# EAGLE design HY28B-LCD (EAGLE 6.4)
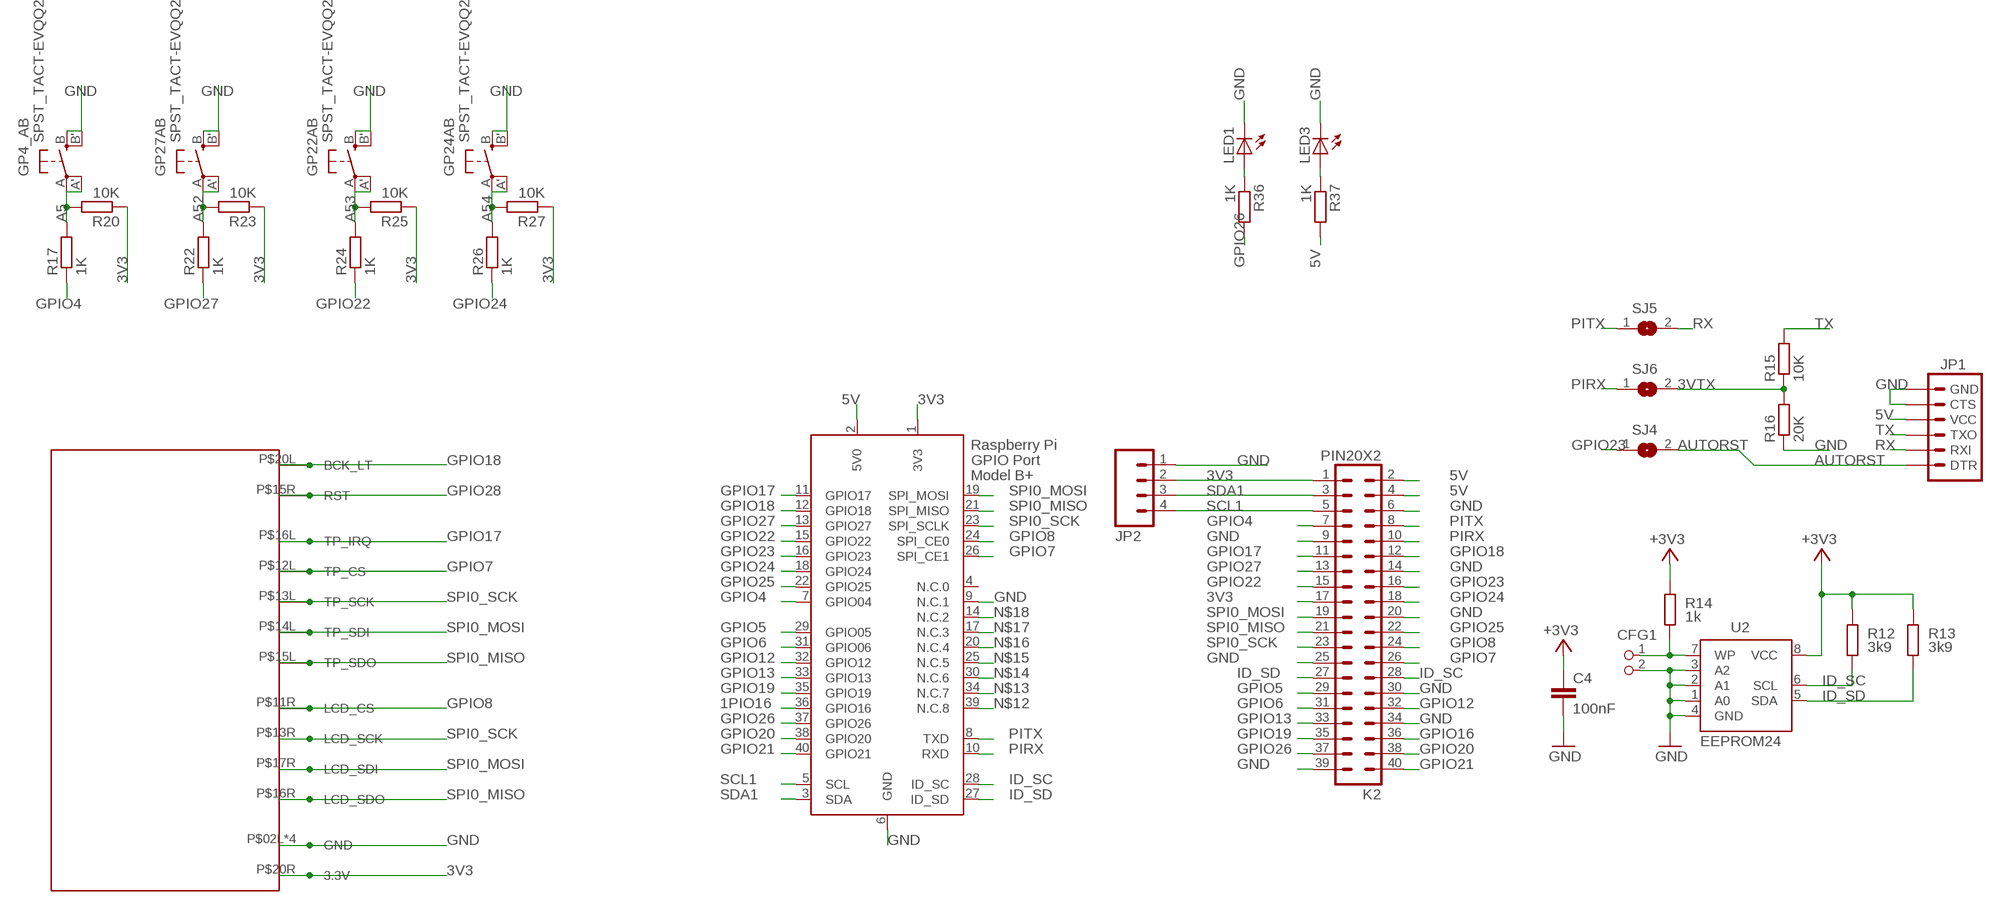
[diagram p0: schematic, sheet 1]

## Parts
C4  100nF  C-EUC1206  [C1206]
CFG1  PIN2_100  [PIN_W_2]
GP4_AB  SPST_TACT-EVQQ2  [EVQ-Q2]
GP22AB  SPST_TACT-EVQQ2  [EVQ-Q2]
GP24AB  SPST_TACT-EVQQ2  [EVQ-Q2]
GP27AB  SPST_TACT-EVQQ2  [EVQ-Q2]
JP1  ARDUINO_SERIAL_PROGRAMLOCK  [1X06_LOCK]
JP2  M04LOCK  [1X04_LOCK]
K2  PIN20X2  [PIN_20X2]
LED1  LEDCHIPLED_1206  [CHIPLED_1206]
LED3  LEDCHIPLED_1206  [CHIPLED_1206]
R12  3k9  R-EU_M1206  [M1206]
R13  3k9  R-EU_M1206  [M1206]
R14  1k  R-EU_M1206  [M1206]
R15  10K  RESISTOR-1206  [R1206]
R16  20K  RESISTOR-1206  [R1206]
R17  1K  R-EU_M1206  [M1206]
R20  10K  R-EU_M1206  [M1206]
R22  1K  R-EU_M1206  [M1206]
R23  10K  R-EU_M1206  [M1206]
R24  1K  R-EU_M1206  [M1206]
R25  10K  R-EU_M1206  [M1206]
R26  1K  R-EU_M1206  [M1206]
R27  10K  R-EU_M1206  [M1206]
R36  1K  RESISTOR-1206  [R1206]
R37  1K  RESISTOR-1206  [R1206]
SJ4  SJ  [SJ]
SJ5  SJ  [SJ]
SJ6  SJ  [SJ]
U2  EEPROM24  [SOIC8]
U$1  HY28BSTD  [HY28B]
X1  RASPI_BOARD_B+_F  [RASPI_BOARD_B+_FULL]

## Nets
1PIO16: X1.36(GPIO16)
3V3: JP2.2 K2.1 K2.17 R20.1 R23.1 R25.1 R27.1 U$1.P$20R(3.3V) X1.1(3V3)
3VTX: R15.1 R16.2 SJ6.2
5V: JP1.4(VCC) K2.2 K2.4 R37.2 X1.2(5V0)
+3V3: C4.1 R12.2 R13.2 R14.2 U2.8(VCC)
A5: GP4_AB.A'(P1) GP4_AB.A(P) R17.2 R20.2
A52: GP27AB.A'(P1) GP27AB.A(P) R22.2 R23.2
A53: GP22AB.A'(P1) GP22AB.A(P) R24.2 R25.2
A54: GP24AB.A'(P1) GP24AB.A(P) R26.2 R27.2
AUTORST: JP1.1(DTR) SJ4.2
GND: C4.2 CFG1.2 GP4_AB.B'(S1) GP4_AB.B(S) GP22AB.B'(S1) GP22AB.B(S) GP24AB.B'(S1) GP24AB.B(S) GP27AB.B'(S1) GP27AB.B(S) JP1.5(CTS) JP1.6(GND) JP2.1 K2.6 K2.9 K2.14 K2.20 K2.25 K2.30 K2.34 K2.39 LED1.C LED3.C R16.1 U2.1(A0) U2.2(A1) U2.3(A2) U2.4(GND) U$1.P$02L(GND) U$1.P$02R(GND) U$1.P$19L(GND) U$1.P$19R(GND) X1.6(GND) X1.9(N.C.1)
GPIO4: K2.7 R17.1 X1.7(GPIO04)
GPIO5: K2.29 X1.29(GPIO05)
GPIO6: K2.31 X1.31(GPIO06)
GPIO7: K2.26 U$1.P$12L(TP_CS) X1.26(SPI_CE1)
GPIO8: K2.24 U$1.P$11R(LCD_CS) X1.24(SPI_CE0)
GPIO12: K2.32 X1.32(GPIO12)
GPIO13: K2.33 X1.33(GPIO13)
GPIO16: K2.36
GPIO17: K2.11 U$1.P$16L(TP_IRQ) X1.11(GPIO17)
GPIO18: K2.12 U$1.P$20L(BCK_LT) X1.12(GPIO18)
GPIO19: K2.35 X1.35(GPIO19)
GPIO20: K2.38 X1.38(GPIO20)
GPIO21: K2.40 X1.40(GPIO21)
GPIO22: K2.15 R24.1 X1.15(GPIO22)
GPIO23: K2.16 SJ4.1 X1.16(GPIO23)
GPIO24: K2.18 R26.1 X1.18(GPIO24)
GPIO25: K2.22 X1.22(GPIO25)
GPIO26: K2.37 R36.2 X1.37(GPIO26)
GPIO27: K2.13 R22.1 X1.13(GPIO27)
GPIO28: U$1.P$15R(RST)
ID_SC: K2.28 R12.1 U2.6(SCL) X1.28(ID_SC)
ID_SD: K2.27 R13.1 U2.5(SDA) X1.27(ID_SD)
N$1: CFG1.1 R14.1 U2.7(WP)
N$2: LED1.A R36.1
N$3: LED3.A R37.1
N$12: X1.39(N.C.8)
N$13: X1.34(N.C.7)
N$14: X1.30(N.C.6)
N$15: X1.25(N.C.5)
N$16: X1.20(N.C.4)
N$17: X1.17(N.C.3)
N$18: X1.14(N.C.2)
PIRX: K2.10 SJ6.1 X1.10(RXD)
PITX: K2.8 SJ5.1 X1.8(TXD)
RX: JP1.2(RXI) SJ5.2
SCL1: JP2.4 K2.5 X1.5(SCL)
SDA1: JP2.3 K2.3 X1.3(SDA)
SPI0_MISO: K2.21 U$1.P$15L(TP_SDO) U$1.P$16R(LCD_SDO) X1.21(SPI_MISO)
SPI0_MOSI: K2.19 U$1.P$14L(TP_SDI) U$1.P$17R(LCD_SDI) X1.19(SPI_MOSI)
SPI0_SCK: K2.23 U$1.P$13L(TP_SCK) U$1.P$13R(LCD_SCK) X1.23(SPI_SCLK)
TX: JP1.3(TXO) R15.2
Unconnected: X1.4(N.C.0)

## Library data of the parts
C4 = resistor:C-EU: CAPACITOR, European symbol; DIELECTRIC: X7R
CFG1 = FLYFISH:PIN2
GP4_AB GP22AB GP24AB GP27AB = adafruit:SPST_TACT: SMT 6mm switch, EVQQ2 series http://www.ladyada.net/library/eagle
JP1 = SparkFun-Connectors:ARDUINO_SERIAL_PROGRAM: FTDI connector footprints
JP2 = SparkFun-Connectors:M04: Header 4 Standard 4-pin 0.1" header. Use with straight break away headers (SKU : PRT-00116), right angle break away headers (PRT-00553), swiss pins (PRT-00743), machine pins (PRT-00117), and female headers (PRT-00115). Molex polarized connector foot print use with SKU : PRT-08231 with associated crimp pins and housings. 1MM SMD Version SKU: PRT-10208
K2 = FLYFISH:PIN20X2
LED1 LED3 = adafruit:LED: LED OSRAM: - CHIPLED LG R971, LG N971, LY N971, LG Q971, LY Q971, LO R971, LY R971 LH N974, LH R974 LS Q976, LO Q976, LY Q976 LO Q996 - Hyper CHIPLED LW Q18S LB Q993, LB Q99A, LB R99A - SideLED LS A670, LO A670, LY A670, LG A670, LP A670 LB A673, LV A673, LT A673, LW A673 LH A674 LY A675 LS A676, LA A676, LO A676, LY A676, LW A676 LS A679, LY A679, LG A679 - Hyper Micro SIDELED® LS Y876, LA Y876, LO Y876, LY Y876 LT Y87S - SmartLED LW L88C, LW L88S LB L89C, LB L89S, LG L890 LS L89K, LO L89K, LY L89K LS L896, LA L896, LO L896, LY L896 - TOPLED LS T670, LO T670, LY T670, LG T670, LP T670 LSG T670, LSP T670, LSY T670, LOP T670, LYG T670 LG T671, LOG T671, LSG T671 LB T673, LV T673, LT T673, LW T673 LH T674 LS T676, LA T676, LO T676, LY T676, LB T676, LH T676, LSB T676, LW T676 LB T67C, LV T67C, LT T67C, LS T67K, LO T67K, LY T67K, LW E67C LS E67B, LA E67B, LO E67B, LY E67B, LB E67C, LV E67C, LT E67C LW T67C LS T679, LY T679, LG T679 LS T770, LO T770, LY T770, LG T770, LP T770 LB T773, LV T773, LT T773, LW T773 LH T774 LS E675, LA E675, LY E675, LS T675 LS T776, LA T776, LO T776, LY T776, LB T776 LHGB T686 LT T68C, LB T68C - Hyper Mini TOPLED® LB M676 - Mini TOPLED Santana® LG M470 LS M47K, LO M47K, LY M47K Source: http://www.osram.convergy.de/
R12-R14 = resistor:R-EU_: RESISTOR, European symbol; TOLERANCE: 5%
R15 R16 R36 R37 = dp_devices:RESISTOR
R17 R20 R22-R27 = resistor:R-EU_: RESISTOR, European symbol
SJ4-SJ6 = jumper:SJ: SMD solder JUMPER
U2 = FLYFISH:EEPROM24
U$1 = hy28b:HY28B
X1 = raspberrypi_bastelstube_v13:RASPI_BOARD_B+: Raspberry Pi GPIO connector with markings for the outer dimensions of the Raspberry Pi board model B+ with different sets of drill holes or mounting pads

## Board
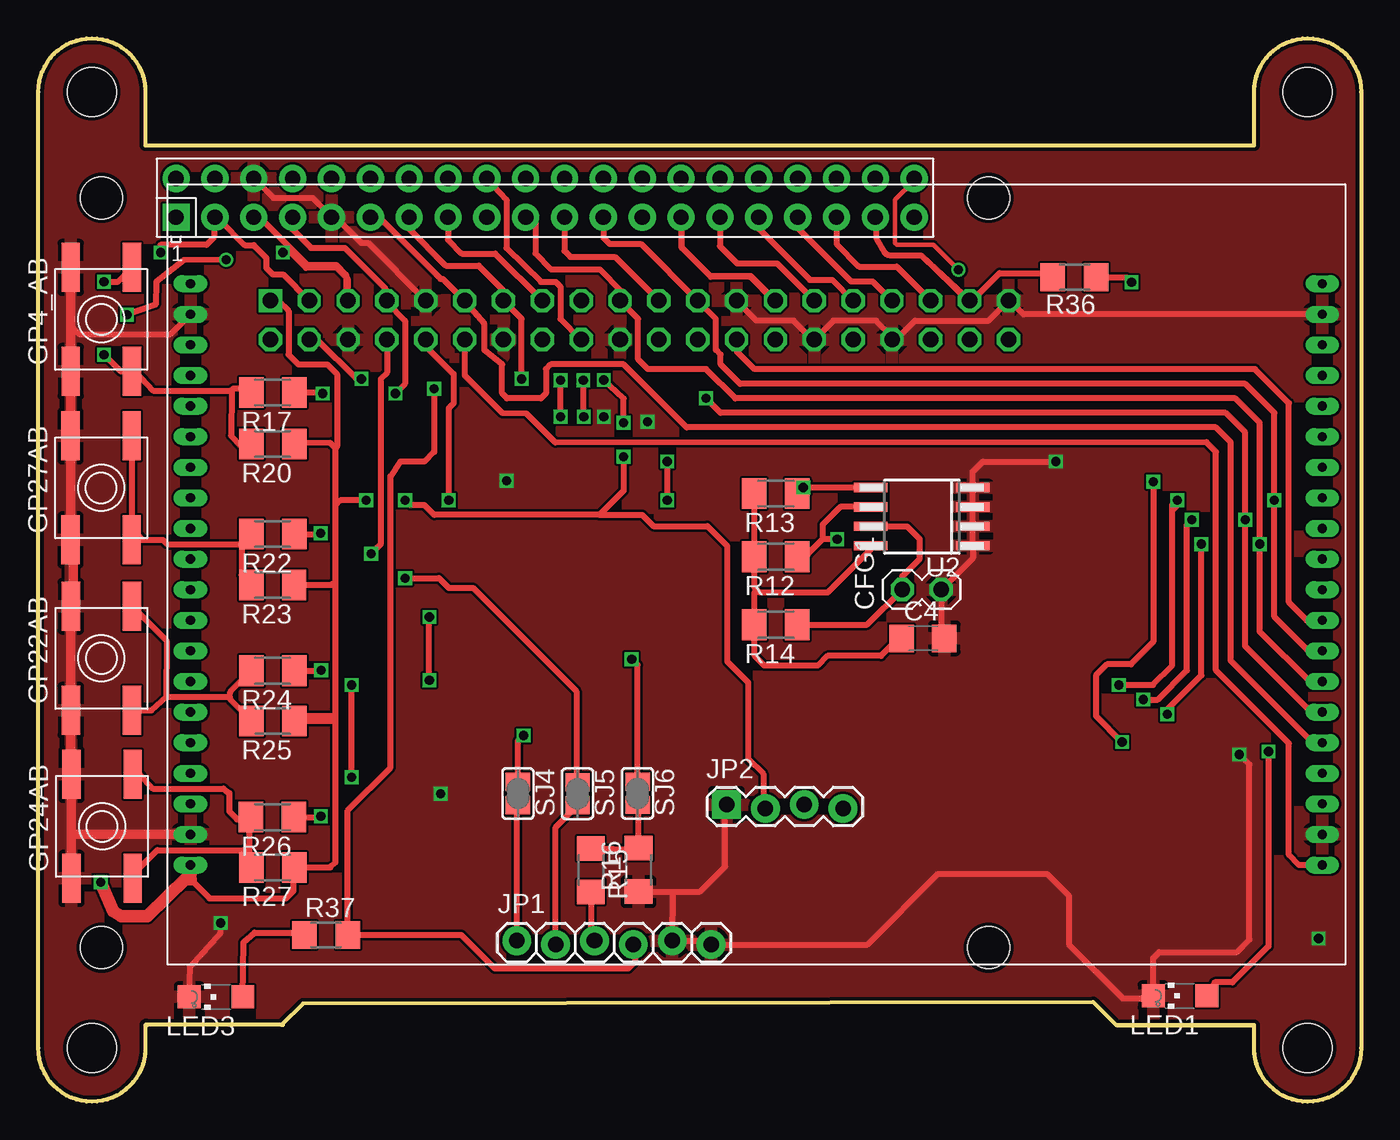
[diagram p1: board, top side]
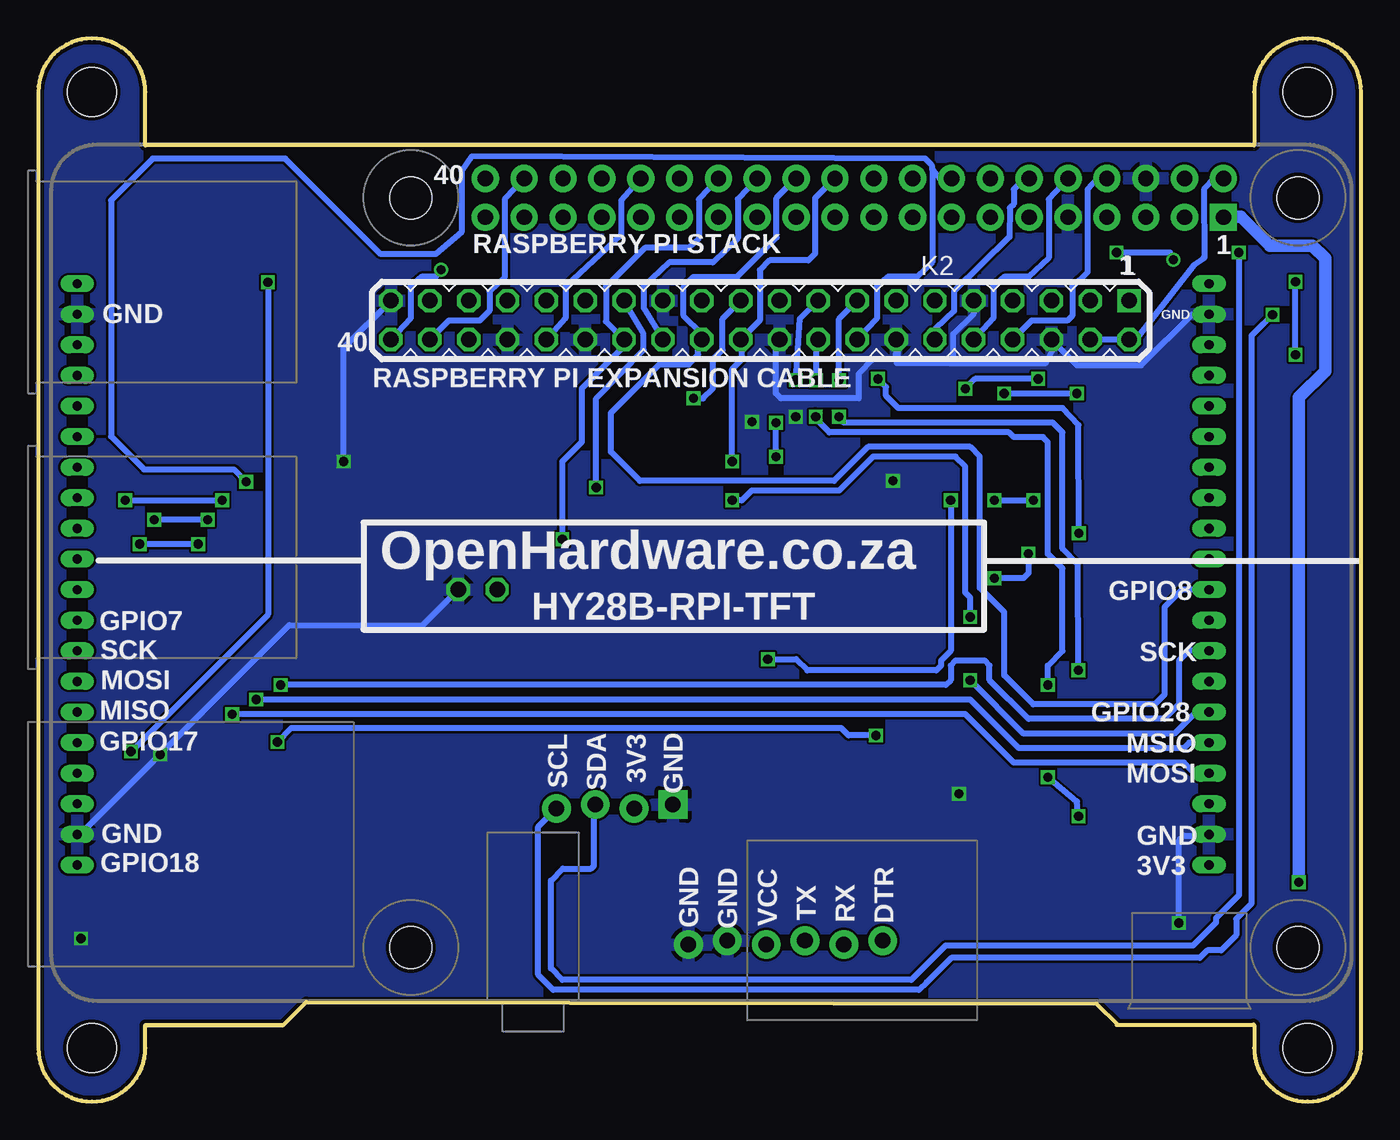
[diagram p2: board, bottom side, seen from below]

Size 86.5 x 69.5 mm. Coordinates in mm from the lower left corner, seen from the top.
Outline: 79.5,5 79.5,3.5 arc180 86.5,3.5 86.5,66 arc180 79.5,66 79.5,62.5 7,62.5 7,66 arc180 0,66 0,3.5 arc180 7,3.5 7,4.98
Outline: 79.5,5 79.46,4.97 79.5,5 70.47,5 68.98,6.5 17.3,6.41 15.92,5.02 7.15,5.02 7,4.98
Outline: 7,4.98 7.06,5.04
Outline: 16,5.02 7,5.02
Outline: 70.5,5 79.5,5
Copper layers (1*16): Top 0.035mm / dielectric 1.5mm / Bottom 0.035mm
Design rules "dirt_cheap_dirty_boards.v1 *": minimum track width 5mil, minimum drill 12mil, track to track 6mil, track to pad 6mil, pad to pad 6mil, via to via 6mil, smd to smd 0mil, copper to edge 10mil, drill to drill 10mil, minimum pad ring 10mil, minimum via ring 6mil, stop-mask expansion 2mil, vias tented up to drill 25mil, thermal gap 10mil
Holes 3.2 mm at 83,3.5 3.5,3.5 3.5,66 83,66

### Footprints (pad centres in the part's own frame; a part is rotated, then mirrored left to right if it is on the bottom)
C1206 = smd 1.6 x 1.8: 1 -1.4,0; 2 1.4,0
PIN_W_2 = drill 1.016 octagon: 1 0,0; 2 0,-2.54
EVQ-Q2 = smd 3.2 x 1.2: A -3.4,-2; A' 3.4,-2; B -3.4,2; B' 3.4,2
1X06_LOCK = drill 1.016 pad 1.88: 1 0,0; 2 2.54,-0.254; 3 5.08,0; 4 7.62,-0.254; 5 10.16,0; 6 12.7,-0.254
1X04_LOCK = drill 1.016 pad 1.88 square: 1 0,0.127 | drill 1.016 pad 1.88: 2 2.54,-0.127; 3 5.08,0.127; 4 7.62,-0.127
PIN_20X2 = drill 1.016 square: 1 -24.13,-1.27 | drill 1.016 octagon: 2 -24.13,1.27; 3 -21.59,-1.27; 4 -21.59,1.27; 5 -19.05,-1.27; 6 -19.05,1.27; 7 -16.51,-1.27; 8 -16.51,1.27; 9 -13.97,-1.27; 10 -13.97,1.27; 11 -11.43,-1.27; 12 -11.43,1.27; 13 -8.89,-1.27; 14 -8.89,1.27; 15 -6.35,-1.27; 16 -6.35,1.27; 17 -3.81,-1.27; 18 -3.81,1.27; 19 -1.27,-1.27; 20 -1.27,1.27; 21 1.27,-1.27; 22 1.27,1.27; 23 3.81,-1.27; 24 3.81,1.27; 25 6.35,-1.27; 26 6.35,1.27; 27 8.89,-1.27; 28 8.89,1.27; 29 11.43,-1.27; 30 11.43,1.27; 31 13.97,-1.27; 32 13.97,1.27; 33 16.51,-1.27; 34 16.51,1.27; 35 19.05,-1.27; 36 19.05,1.27; 37 21.59,-1.27; 38 21.59,1.27; 39 24.13,-1.27; 40 24.13,1.27
CHIPLED_1206 = smd 1.5 x 1.5: A 0,-1.75; C 0,1.75
M1206 = smd 1.6 x 2: 1 -1.4,0; 2 1.4,0
R1206 = smd 1.6 x 1.803: 1 -1.422,0; 2 1.422,0
SJ = smd 1.168 x 1.6: 1 -0.762,0; 2 0.762,0
SOIC8 = smd 0.6 x 2.2: 1 -1.905,-3.33; 2 -0.635,-3.33; 3 0.635,-3.33; 4 1.905,-3.33; 5 1.905,3.33; 6 0.635,3.33; 7 -0.635,3.33; 8 -1.905,3.33
HY28B = drill 0.6 long: P$01L 74,38; P$01R 0,38; P$02L 74,36; P$02R 0,36; P$03L 74,34; P$03R 0,34; P$04L 74,32; P$04R 0,32; P$05L 74,30; P$05R 0,30; P$06L 74,28; P$06R 0,28; P$07L 74,26; P$07R 0,26; P$08L 74,24; P$08R 0,24; P$09L 74,22; P$09R 0,22; P$10L 74,20; P$10R 0,20; P$11L 74,18; P$11R 0,18; P$12L 74,16; P$12R 0,16; P$13L 74,14; P$13R 0,14; P$14L 74,12; P$14R 0,12; P$15L 74,10; P$15R 0,10; P$16L 74,8; P$16R 0,8; P$17L 74,6; P$17R 0,6; P$18L 74,4; P$18R 0,4; P$19L 74,2; P$19R 0,2; P$20L 74,0; P$20R 0,0
RASPI_BOARD_B+_FULL = drill 1 pad 1.778 square: 1 8.37,51.23 | drill 1 pad 1.778: 2 8.37,53.77; 3 10.91,51.23; 4 10.91,53.77; 5 13.45,51.23; 6 13.45,53.77; 7 15.99,51.23; 8 15.99,53.77; 9 18.53,51.23; 10 18.53,53.77; 11 21.07,51.23; 12 21.07,53.77; 13 23.61,51.23; 14 23.61,53.77; 15 26.15,51.23; 16 26.15,53.77; 17 28.69,51.23; 18 28.69,53.77; 19 31.23,51.23; 20 31.23,53.77; 21 33.77,51.23; 22 33.77,53.77; 23 36.31,51.23; 24 36.31,53.77; 25 38.85,51.23; 26 38.85,53.77; 27 41.39,51.23; 28 41.39,53.77; 29 43.93,51.23; 30 43.93,53.77; 31 46.47,51.23; 32 46.47,53.77; 33 49.01,51.23; 34 49.01,53.77; 35 51.55,51.23; 36 51.55,53.77; 37 54.09,51.23; 38 54.09,53.77; 39 56.63,51.23; 40 56.63,53.77 | hole 2.75: 3.5,3.5; 3.5,52.5; 61.5,3.5; 61.5,52.5

### Placement (x,y rotation side)
C4  57.84,30.28 0 top
CFG1  56.5,33.47 90 top
GP4_AB  4.12,51.12 90 top
GP22AB  4.13,28.98 90 top
GP24AB  4.17,17.99 90 top
GP27AB  4.11,40.12 90 top
JP1  31.29,10.52 0 top
JP2  45,19.29 0 top
K2  39.31,51.08 180 bottom
LED1  74.64,6.92 90 top
LED3  11.63,6.84 90 top
R12  48.23,35.62 180 top
R13  48.23,39.74 180 top
R14  48.23,31.17 180 top
R15  36.13,15.13 270 top
R16  39.25,15.14 90 top
R17  15.33,46.35 180 top
R20  15.34,42.99 180 top
R22  15.34,37.09 180 top
R23  15.33,33.77 180 top
R24  15.34,28.16 180 top
R25  15.34,24.88 180 top
R26  15.31,18.59 180 top
R27  15.34,15.31 180 top
R36  67.76,53.88 180 top
R37  18.81,10.89 0 top
SJ4  31.36,20.14 270 top
SJ5  35.26,20.12 270 top
SJ6  39.18,20.15 270 top
U2  57.77,38.23 90 top
U$1  9.95,15.46 0 top
X1  0.64,6.57 0 top

### Tracks (layer width: path | path; a pad name or v marks a point on that pad's centre or on a via)
3V3  (via drill 0.6)
  Top 0.406: 9.95,14.54 11.2,13.29 16.21,13.29 16.69,13.77 16.69,15.26 R27.1 19.1,15.31 19.43,15.65 19.43,24.92 19.15,25.2 17.05,25.19 R25.1 19.35,24.89 19.43,24.97 19.43,34.02 | 19.43,34.02 19.43,38.98 | 19.43,38.98 19.43,42.72 | 19.43,42.72 19.1,43.05 16.79,43.04 R20.1 | R23.1 19.19,33.77 19.43,34.02 | K2.1 15.7,52.35 16.36,51.68 16.36,48.82 17,48.19 18.9,48.19 19.54,47.55 19.54,42.82 19.43,42.72 | v38.27,44.38 38.27,45.96 v36.97,47.16 | v38.27,42.15 38.27,39.93 36.68,38.34 | 36.68,38.34 25.89,38.34 25.25,38.98 24.3,38.98 v23.98,39.3 | v21.44,39.3 19.75,39.3 19.43,38.98 | 36.68,38.34 39.48,38.34 40.21,37.61 43.75,37.61 45.04,36.32 45.04,28.77 46.41,27.4 46.41,22.42 47.41,21.42 47.41,19.29 JP2.2
  Top 0.813: U$1.P$20R 9.95,14.88 9.7,14.63 | 9.7,14.63 7.13,12.12 5.42,12.12 4.91,12.44 v4.08,14.34 | 9.95,14.54 9.79,14.54 9.7,14.63
  Bottom 0.406: v38.27,42.15 v38.27,44.38 | v36.97,47.16 36.71,51.17 K2.17 | v23.98,39.3 v21.44,39.3
  Bottom 0.813: v4.08,14.34 4.08,46.03 2.37,47.75 2.37,55.11 3.19,55.94 5.99,55.94 7.89,57.84 8.97,57.84 X1.1
3VTX
  Top 0.406: R15.1 39.19,16.51 R16.2 39.25,19.32 SJ6.2
5V  (via drill 0.6)
  Top 0.406: K2.4 18.24,49.81 20.81,47.23 v21.12,47.23 | v25.89,46.6 25.89,42.47 25.25,41.84 23.66,41.84 23.03,40.88 23.03,21.83 20.24,19.04 R37.2 27.66,10.89 29.84,8.71 38.59,8.71 39.04,9.16 39.04,10.14 JP1.4
  Bottom 0.406: X1.2 9.61,60.34 10.29,59.62 10.27,55.13 | 10.32,55.16 10.27,55.13 | 10.27,55.13 10.94,54.67 14.77,49.77 15.15,49.77 K2.2 K2.4 | v21.12,47.23 25.25,47.23 v25.89,46.6
+3V3
  Top 0.406: U2.8 54.44,36.1 51.6,33.26 47.16,33.26 47,33.42 | 47,33.42 46.84,33.58 46.84,35.6 R12.2 R13.2 | 47,33.42 46.83,33.25 R14.2 46.84,31.15 46.84,29.14 47.48,28.5 50.97,28.5 51.6,29.14 55.1,29.14 56.24,30.28 C4.1
A5  (via drill 0.6)
  Top 0.406: 12.64,46.47 7.5,46.47 6.35,47.72 GP4_AB.A 5.4,47.72 v4.3,48.82 | 12.64,46.47 12.75,46.6 | R17.2 13.68,46.6 12.75,46.6 | 12.64,46.47 12.61,43.52 13.25,42.88 13.83,42.88 R20.2 | 12.75,46.6 12.7,46.55 12.58,46.48 12.63,46.44 | v4.3,53.58 5.18,53.58 GP4_AB.A'
  Bottom 0.406: v4.3,48.82 v4.3,53.58
A52
  Top 0.406: GP27AB.A 6.84,36.72 | 6.84,36.72 8.15,36.72 8.42,36.44 13.28,36.44 | 13.28,36.44 R22.2 | 13.28,36.44 13.28,34.41 R23.2 | GP27AB.A' 6.11,37.48 6.52,37.07 6.52,37.04 6.84,36.72
A53
  Top 0.406: GP22AB.A 7.4,25.58 8.39,26.46 | 8.39,26.46 12.51,26.46 | 12.51,26.46 12.55,26.78 R24.2 | 12.51,26.46 12.55,26.27 R25.2 | 8.39,26.46 8.42,30.08 GP22AB.A'
A54
  Top 0.406: GP24AB.A' 6.64,21.39 7.48,20.46 12.1,20.46 12.49,20.16 12.49,18.97 13,18.45 13.78,18.45 | 13.78,18.45 R26.2 | 13.78,18.45 13.78,16.75 | 13.78,16.75 13.78,15.47 R27.2 | GP24AB.A 6.17,14.82 7.79,16.44 13.46,16.44 13.78,16.75
AUTORST
  Top 0.406: JP1.1 31.29,19.3 SJ4.2
GND  (via drill 0.6)
  Top 0.406: U$1.P$02L 64.41,51.46 63.52,52.35 K2.39 62.14,51.04 57.32,51.04 56.08,49.81 K2.34 55.82,50.01 54.78,51.04 51.98,51.04 K2.30 50.62,49.81 49.38,51.04 46.96,51.04 K2.25 | K2.9 21.56,56.12 21.12,56.12 19.45,57.8 X1.9 17.94,59.06 15.36,59.06 14.09,60.3 X1.6 | v66.53,41.84 61.76,41.84 61.1,41.17 U2.4 U2.3 U2.2 U2.1 61.1,35.53 CFG1.2 59.04,30.49 C4.2 | U$1.P$19R 4.37,17.46 4.3,17.39 | LED3.C 9.93,8.82 11.92,11.04 v11.92,11.67 | 2.12,51.46 2.12,50.73 2.69,50.16 8.65,50.16 U$1.P$02R | JP2.1 44.91,19.33 44.91,15.36 43.27,13.72 R16.1 41.46,13.71 JP1.5 43.74,10.52 JP1.6 54.2,10.27 58.82,14.89 65.95,14.89 67.39,13.45 67.39,10.26 70.91,6.75 72.72,6.75 LED1.C 72.89,9.38 73.3,9.78 78.36,9.78 79.19,10.61 79.19,22.03 v78.53,22.69
  Top 0.61: GP24AB.B 2.17,17.46 | 2.17,17.46 GP24AB.B' 2.13,21.39 GP22AB.B GP22AB.B' 2.29,32.38 2.29,37.55 2.11,37.55 GP27AB.B GP27AB.B' 2.12,43.52 GP4_AB.B 2.12,51.46 GP4_AB.B' | U$1.P$19R 2.17,17.46
  Bottom 0.406: 30.42,48.91 30.42,48.74 30.33,49.77 30.33,48.5 31.92,48.5 32.87,47.55 32.87,45.96 37.95,45.96 38.27,46.28 38.27,49.72 K2.20 | K2.14 30.42,48.91 | 30.42,48.91 30.36,48.28 26.94,48.27 | 26.94,48.27 20.63,48.27 20.17,49.14 20.17,49.72 | 20.17,49.72 K2.6 | v66.53,41.84 66.53,49.26 K2.39 | U$1.P$19L 83.76,17.46 v78.53,22.69 70.08,31.14 61.37,31.14 CFG1.2 | 20.17,49.72 20.18,49.72 | 20.18,49.72 20.24,49.77 | 20.18,49.72 18.58,48.12 14.4,48.12 11.06,51.46 U$1.P$02R | v11.92,11.67 11.92,17.07 11.6,17.39 10.02,17.39 U$1.P$19R | K2.9 25.34,51.51 26.69,50.16 26.69,48.53 26.94,48.27
  other vias: 26.31,20.12 30.62,40.57 83.71,10.66 39.83,44.44 36.97,44.76
  pour Top: -3.79,71.24 89.04,71.24 89.04,-3.18 -5.13,-3.18
  pour Bottom: -2.9,72.26 89.55,72.26 88.22,-3.25 -4.24,-3.25
GPIO4  (via drill 0.6)
  Top 0.406: X1.7 16.63,57 17.84,55.8 20.03,55.8 22.7,53.13 22.7,52.44 K2.7 22.8,52.23 23.98,51.04 23.98,46.92 v23.35,46.28 | R17.1 18.52,46.35 v18.58,46.28
  Bottom 0.406: v23.35,46.28 v18.58,46.28
GPIO5
  Top 0.406: X1.29 44.57,55.91 45.7,54.78 48.3,54.78 K2.29
GPIO6
  Top 0.406: X1.31 47.11,57.04 50.44,53.71 51.92,53.71 K2.31
GPIO7
  Top 0.406: U$1.P$12L 82.94,31.46 81.77,32.63 81.77,45.65 79.54,47.87 46.84,47.87 45.66,49.05 K2.26
  Bottom 0.406: X1.26 39.49,60.3 40.76,58.98 40.76,56.44 42.4,54.85 45.25,54.85 46.94,53.31 46.92,51.88 K2.26
GPIO8
  Bottom 0.406: X1.24 38.22,59.07 38.22,56.49 40.81,53.9 43.67,53.9 44.3,53.27 44.3,51.36 43.12,50.18 K2.24 43.35,49.57 43.35,48.82 43.98,48.19 45.89,48.19 49.06,45.01 49.06,42.47 47.16,40.57 34.46,40.57 32.24,42.79 25.57,42.79 24.93,42.15 24.93,33.58 23.35,31.99 23.35,27.87 21.44,25.96 13.5,25.96 12.87,26.6 12.87,32.31 11.72,33.46 U$1.P$11R
GPIO12
  Bottom 0.406: X1.32 47.11,60.3 48.39,58.88 48.39,56.66 52.03,53.29 52.03,51.18 K2.32
GPIO13
  Top 0.406: X1.33 49.65,57.11 53.15,53.62 54.55,53.62 K2.33
GPIO17
  Top 0.406: U$1.P$16L 83.32,23.46 77.96,28.82 77.96,43.11 77,44.06 42.4,44.06 38.27,48.19 33.51,48.19 33.19,47.87 33.19,46.28 32.87,45.96 30.65,45.96 30.33,46.28 30.33,48.19 29.18,49.12 29.18,50.83 K2.11 26.45,53.78 26.3,53.78 22.27,57.8 X1.11
GPIO18
  Top 0.406: U$1.P$20L 82.43,15.46 81.77,16.12 81.77,23.42 77,28.18 77,42.47 76.37,43.11 33.81,43.08 31.91,44.98 30.33,45.01 27.88,47.47 K2.12
  Bottom 0.406: X1.12 21.99,60.34 22.71,59.62 22.71,58.66 22.98,58.41 22.99,56.51 26.62,52.97 26.62,51.69 27.83,50.54 27.89,50.16 K2.12
GPIO19
  Top 0.406: X1.35 52.19,56.06 53.67,54.58 56.13,54.58 K2.35
GPIO20
  Bottom 0.406: X1.38 54.73,60.3 56.01,58.97 56.01,53.89 57,52.95 57,51.68 57.64,51.04 59.66,51.04 K2.38
GPIO21  (via drill 0.6)
  Top 0.305: X1.40 57.27,60.2 56.01,58.95 56.01,56.11 56.13,56.01 58.52,56.01 v60.17,54.36
  Bottom 0.305: v60.17,54.36 60.17,54.23 60.49,53.9
  Bottom 0.406: 60.49,53.9 61.45,53.9 62.17,53.29 62.17,51.18 K2.40
GPIO22  (via drill 0.6)
  Top 0.406: X1.15 26.79,56.33 27.69,55.43 29.87,55.43 K2.15 | R24.1 18.56,28.16 v18.5,28.2 | v34.14,44.76 v34.14,47.14
  Bottom 0.406: v18.5,28.2 18.53,35.1 19.54,36.12 19.54,43.74 20.17,44.38 33.82,44.38 v34.14,44.76 | v34.14,47.14 34.14,51.16 K2.15
GPIO23  (via drill 0.6)
  Top 0.406: v72.9,40.52 72.9,30.04 71.45,28.59 69.88,28.59 69.15,27.86 69.15,25.22 v70.86,23.5 | SJ4.1 31.36,23.57 v31.73,23.93
  Bottom 0.406: 26.79,60.3 X1.16 27.56,60.34 28.05,60.91 | 28.05,60.91 28.11,61.24 28.5,61.63 58.16,61.77 58.82,60.85 58.82,56.81 60.51,55.39 64.11,55.39 70.35,61.63 79.02,61.63 81.74,58.91 81.74,43.48 79.59,41.32 73.71,41.32 v72.9,40.52 | 28.05,60.91 28.05,54.87 29.06,53.9 30.97,53.9 31.67,53.28 31.67,51.18 K2.16 | v31.73,23.93 33.52,23.93 34,24.41 69.95,24.41 v70.86,23.5
GPIO24  (via drill 0.6)
  Top 0.406: X1.18 29.33,60.3 30.61,58.95 30.61,55.78 32.87,53.58 33.82,53.58 34.14,53.27 34.14,51.16 K2.18 | R26.1 18.52,18.59 v18.48,18.64 | v20.49,21.2 v20.49,27.23 | v35.67,44.76 35.67,47.11 v35.63,47.14
  Bottom 0.406: v18.48,18.64 18.58,19.61 v20.49,21.2 | v20.49,27.23 20.49,28.5 19.54,29.45 19.54,34.85 20.49,35.8 20.49,43.11 20.81,43.42 22.71,43.42 23.03,43.74 34.78,43.74 35.7,44.66 35.7,45.04 v35.67,44.76 | v35.63,47.14 35.63,49.67 K2.18
GPIO25
  Bottom 0.406: X1.22 35.7,59.05 35.7,55.43 36.15,54.98 38.69,54.98 39.32,54.35 39.32,51.06 K2.22
GPIO26
  Top 0.406: X1.37 54.78,56.44 55.29,55.54 55.5,55.36 55.7,55.31 57.71,55.31 | 57.71,55.31 57.77,55.27 K2.37 61.03,52.35 62.84,54.16 66.06,54.16 R36.2 | 57.71,55.31 60.81,52.31
GPIO27  (via drill 0.6)
  Top 0.406: X1.13 24.25,57.03 26.65,54.64 28.79,54.64 30.4,53.03 30.4,52.37 K2.13 31.6,51.16 v31.6,47.23 | R22.1 18.57,37.09 v18.47,37.14
  Bottom 0.406: v18.47,37.14 18.49,44.21 19.54,45.33 30.27,45.33 31.06,46.12 31.06,46.7 v31.6,47.23
GPIO28  (via drill 0.6)
  Top 0.406: v25.57,27.55 v25.57,31.68 | v41.13,39.3 v41.13,41.84
  Bottom 0.406: U$1.P$15R 10.83,25.46 12.23,24.06 22.08,24.06 v25.57,27.55 | v25.57,31.68 25.57,32.95 25.89,33.26 25.89,41.52 26.52,42.15 31.92,42.15 34.14,39.93 39.86,39.93 40.49,39.3 v41.13,39.3 | v41.13,41.84 41.13,47.87 40.49,48.5 40.49,49.72
ID_SC  (via drill 0.6)
  Top 0.406: U2.6 52.44,38.87 51.29,37.71 51.29,36.76 | 51.29,36.76 50.33,35.8 49.81,35.8 R12.1 | v52.24,36.76 51.29,36.76
  Bottom 0.406: X1.28 42.03,60.3 43.31,58.97 43.31,56.43 43.98,55.81 46.84,55.81 49.38,53.27 49.38,50.99 K2.28 48.2,49.37 50.97,46.6 50.97,43.11 52.24,41.84 v52.24,36.76
ID_SD  (via drill 0.6)
  Top 0.406: X1.27 42.03,55.86 43.93,53.97 46.58,53.97 K2.27 48.08,52.35 46.52,53.9 43.98,53.9 42.08,55.81 42.08,57.71 | U2.5 v50.02,40.14 R13.1
  Bottom 0.406: v50.02,40.14 50.02,45.96 46.91,49.13 46.93,50.21 K2.27
N$1
  Top 0.406: R14.1 54.2,31.17 CFG1.1 56.5,34.35 57.64,35.49 57.64,36.76 56.8,37.6 U2.7
N$2  (via drill 0.6)
  Top 0.406: R36.1 71.15,53.88 v71.48,53.55 | v80.43,22.88 80.43,10.15 78.08,7.8 76.92,7.8 LED1.A
  Bottom 0.406: v71.48,53.55 71.48,31.84 v80.43,22.88
N$3
  Top 0.406: LED3.A 13.43,10.42 14.14,11.04 17.25,11.04 R37.1
PIRX  (via drill 0.6)
  Top 0.406: K2.10 25.34,49.37 27.16,47.55 27.16,45.65 26.84,45.33 v26.84,39.3 | SJ6.1 39.18,28.54 v38.8,28.92
  Bottom 0.406: X1.10 19.17,60.3 20.43,58.96 20.43,55.15 21.76,53.9 23.35,53.9 24.07,53.3 24.07,51.19 K2.10 | v26.84,39.3 26.84,29.45 27.47,28.82 27.47,28.5 27.79,28.18 36.21,28.18 36.95,28.92 v38.8,28.92
PITX  (via drill 0.6)
  Top 0.406: K2.8 22.8,47.64 22.39,47.23 22.39,36.44 v21.76,35.8 | v23.98,34.22 26.2,34.22 26.84,33.58 28.42,33.58 35.18,26.82 35.18,20.96 SJ5.1
  Bottom 0.406: X1.8 17.23,60.34 17.9,59.61 17.9,54.21 18.9,53.27 18.9,51.36 19.22,51.04 21.56,51.04 K2.8 | v21.76,35.8 21.76,34.53 22.08,34.22 v23.98,34.22
RX
  Top 0.406: JP1.2 33.83,17.93 SJ5.2
SCL1  (via drill 0.6)
  Top 0.406: X1.5 14.48,57.8 17.59,54.68 19.49,54.68 20.12,54.06 20.12,52.48 K2.5 20.26,53.74 19.5,54.5 17.5,54.5 16.5,55.5 v16,55.5 | v12.29,55.03 9.52,55 7.72,53.59 7.67,52.09 v5.8,51.44
  Bottom 0.406: v16,55.5 12.5,55.5 v12.29,55.03 | v5.8,51.44 6.44,50.81 7.19,50.06 7.19,12.94 8.17,11.95 8.17,10.87 9.16,9.89 10.07,9.89 10.56,9.4 26.8,9.4 28.39,7.81 28.41,7.81 28.92,7.3 52.82,7.3 53.81,8.29 53.81,17.97 JP2.4
SDA1  (via drill 0.6)
  Top 0.406: X1.3 11.55,57.6 11.89,57.6 13.51,55.97 14.09,55.97 14.91,55.15 14.91,54.49 15.34,54.06 16,54.06 K2.3 | 11.5,57.5 11.5,56.5 11,56 8,56 v8,55.5
  Top 0.813: 11.55,57.6 11.55,57.55 11.5,57.5
  Bottom 0.406: v8,55.5 8,13.5 9.5,12 9.5,11.7 11,10.2 27.17,10.2 29.04,8.34 29.05,8.34 29.42,7.96 52.24,7.96 52.99,8.71 52.99,14.45 52.21,15.22 50.35,15.22 50.16,15.41 50.16,19.33 JP2.3
SPI0_MISO  (via drill 0.6)
  Top 0.406: U$1.P$15L 83.22,25.46 78.91,29.77 v78.91,38.03 78.91,43.74 77.64,45.01 44.62,45.01 v43.67,45.96 | X1.21 34.41,55.6 34.8,55.21 37.71,55.21 K2.21 | v72.24,26.28 73.19,26.28 75.1,28.18 75.1,37.71 v75.42,38.03
  Bottom 0.406: v43.67,45.96 43.03,45.96 42.4,46.6 42.4,48.5 41.76,49.14 41.76,51.16 K2.21 | U$1.P$16R 11.24,23.46 11.6,23.1 22.39,23.1 25.57,26.28 v72.24,26.28 | v75.42,38.03 v78.91,38.03
SPI0_MOSI  (via drill 0.6)
  Top 0.406: U$1.P$14L 83.13,27.46 79.86,30.72 v79.86,36.44 79.86,44.38 78.27,45.96 45.57,45.96 43.67,47.87 39.86,47.87 39.22,48.5 39.22,51.16 K2.19 38.14,52.45 38.14,52.98 36.72,54.4 33.54,54.4 32.5,55.44 32.5,57.45 32.24,57.71 X1.19 | v73.83,25.33 73.83,25.64 76.05,27.87 v76.05,36.44
  Bottom 0.406: U$1.P$17R 10.91,21.46 11.6,22.15 22.71,22.15 25.89,25.33 v73.83,25.33 | v76.05,36.44 v79.86,36.44
SPI0_SCK  (via drill 0.6)
  Top 0.406: U$1.P$13L 83.03,29.46 80.81,31.68 v80.81,39.3 80.81,45.01 78.91,46.92 45.89,46.92 44.62,48.19 44.62,48.82 44.3,49.14 44.3,51.16 K2.23 39.41,56.06 37.35,56.06 36.95,56.46 X1.23 | v70.65,27.23 72.88,27.23 74.15,28.5 74.15,38.66 | 74.15,38.66 74.15,38.98 v74.46,39.3 74.46,38.98 74.15,38.66
  Bottom 0.406: U$1.P$13R 11.28,29.46 11.92,28.82 11.92,25.96 12.87,25.01 21.76,25.01 24.3,27.55 24.3,28.5 24.62,28.82 26.52,28.82 26.84,28.5 26.84,27.55 27.16,27.23 v70.65,27.23 | v80.81,39.3 v74.46,39.3
TX
  Top 0.406: R15.2 36.13,11.45 JP1.3

### Text on the board
bPlace: 40 | 1 | RASPBERRY PI STACK | 1 | GND | GND | 40 | RASPBERRY PI EXPANSION CABLE | OpenHardware.co.za | GPIO8 | HY28B-RPI-TFT | GPIO7 | SCK | SCK | MOSI | GPIO28 | MISO | GND | 3V3 | SDA | SCL | MSIO | GPIO17 | MOSI | GND | GND | 3V3 | DTR | VCC | GND | GND | GPIO18 | RX | TX
OHSILK: 1K | 1K | To-do for next version: / 5V terminal for input / Serial to Side | EEPROM24 | 10K | 3K9 | 1K | 3K9 | 10K | 1K | 1K | 100U | 10K | 1K | 10K | 10K | 22K | 1K | + | + | WWW.OPENHARDWARE.CO.ZA | Power: | GPIO26